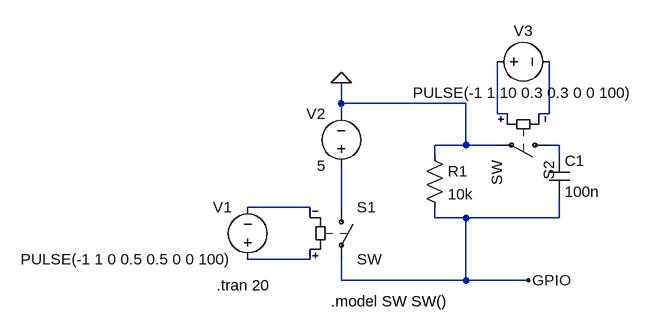
[diagram p0: schematic debounce_circuit.asc]
debounce_circuit.asc, the LTspice schematic file:
Version 4
SHEET 1 880 680
WIRE 192 -64 192 -96
WIRE 384 -64 192 -64
WIRE 192 -48 192 -64
WIRE 432 -48 432 -128
WIRE 448 -48 432 -48
WIRE 512 -48 512 -128
WIRE 512 -48 496 -48
WIRE 384 0 384 -64
WIRE 384 0 336 0
WIRE 432 0 384 0
WIRE 528 0 512 0
WIRE 336 16 336 0
WIRE 528 16 528 0
WIRE 144 96 48 96
WIRE 192 96 192 32
WIRE 144 112 144 96
WIRE 336 112 336 96
WIRE 384 112 336 112
WIRE 528 112 528 80
WIRE 528 112 384 112
WIRE 144 176 144 160
WIRE 144 176 48 176
WIRE 192 208 192 176
WIRE 384 208 384 112
WIRE 384 208 192 208
WIRE 480 208 384 208
FLAG 192 -96 0
FLAG 480 208 GPIO
SYMBOL sw 192 80 R0
SYMATTR InstName S1
SYMBOL voltage 48 192 R180
WINDOW 0 24 96 Left 2
WINDOW 3 24 16 Left 2
WINDOW 123 0 0 Left 0
WINDOW 39 0 0 Left 0
SYMATTR InstName V1
SYMATTR Value PULSE(-1 1 0 0.5 0.5 0 0 100)
SYMBOL voltage 192 48 R180
WINDOW 0 24 96 Left 2
WINDOW 3 24 16 Left 2
WINDOW 123 0 0 Left 0
WINDOW 39 0 0 Left 0
SYMATTR InstName V2
SYMATTR Value 5
SYMBOL res 320 0 R0
SYMATTR InstName R1
SYMATTR Value 10k
SYMBOL sw 528 0 R90
SYMATTR InstName S2
SYMBOL cap 512 16 R0
SYMATTR InstName C1
SYMATTR Value 100n
SYMBOL voltage 416 -128 R270
WINDOW 0 32 56 VTop 2
WINDOW 3 -32 56 VBottom 2
WINDOW 123 0 0 Left 0
WINDOW 39 0 0 Left 0
SYMATTR InstName V3
SYMATTR Value PULSE(-1 1 10 0.3 0.3 0 0 100)
TEXT 0 216 Left 2 !.tran 20
TEXT 176 240 Left 2 !.model SW SW()

The netlist it stands for:
* debounce_circuit.asc
S1 N005 GPIO N006 N004 SW
V1 N006 N004 PULSE(-1 1 0 0.5 0.5 0 0 100)
V2 N005 0 5
R1 0 GPIO 10k
S2 N003 0 N001 N002 SW
C1 N003 GPIO 100n
V3 N001 N002 PULSE(-1 1 10 0.3 0.3 0 0 100)
.tran 20
.model SW SW()
.backanno
.end